# EAGLE design Linetrackerboard (EAGLE 9.6.2)
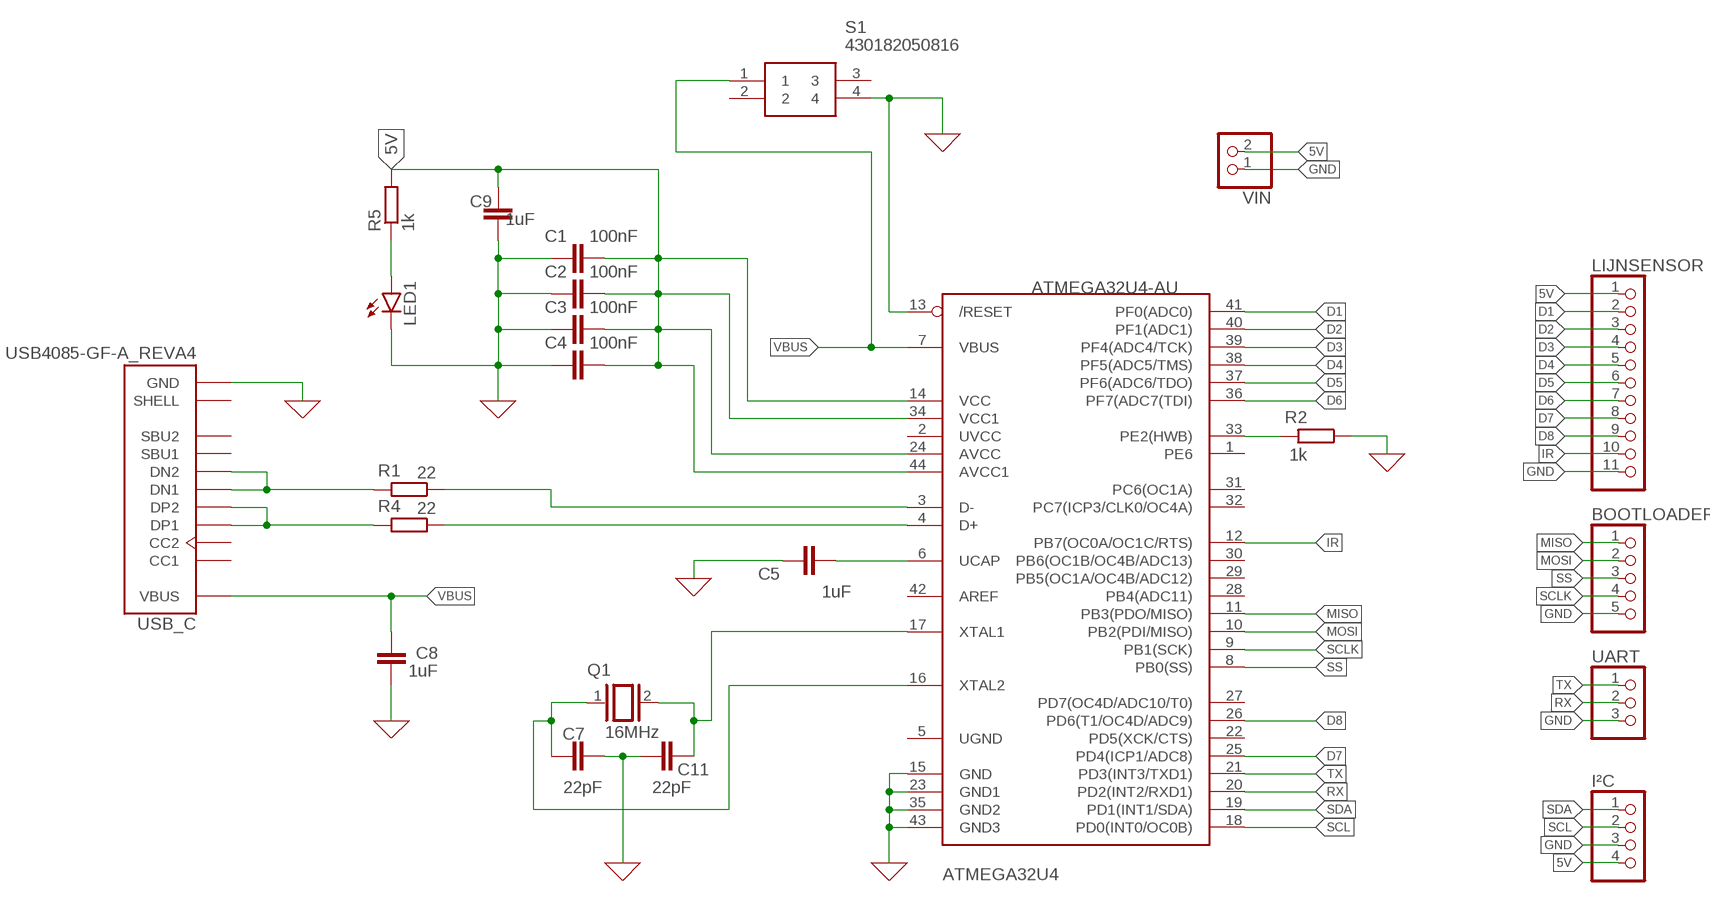
[diagram p0: schematic, sheet 1]

## Parts
ATMEGA32U4  ATMEGA32U4-AU  [TQFP44]
BOOTLOADER  PINHD-1X5  [1X05]
C1  100nF  C-EUC0805  [C0805]
C2  100nF  C-EUC0805  [C0805]
C3  100nF  C-EUC0805  [C0805]
C4  100nF  C-EUC0805  [C0805]
C5  1uF  C-EUC0805  [C0805]
C7  22pF  C-EUC0805  [C0805]
C8  1uF  C-EUC0603  [C0603]
C9  1uF  C-EUC0603  [C0603]
C11  22pF  C-EUC0805  [C0805]
I²C  PINHD-1X4  [1X04]
LED1  LED  [SMARTLED-TTW]
LIJNSENSOR  PINHD-1X11  [1X11]
Q1  16MHz  XTAL/S  [QS]
R1  22  R-EU_M0805  [M0805]
R2  1k  R-EU_M0805  [M0805]
R4  22  R-EU_M0805  [M0805]
R5  1k  R-EU_M0805  [M0805]
S1  430182050816  [430182070816]
UART  PINHD-1X3  [1X03]
USB_C  USB4085-GF-A_REVA4  [GCT_USB4085-GF-A_REVA4]
VIN  PINHD-1X2  [1X02]

## Nets
0: ATMEGA32U4.13(/RESET) ATMEGA32U4.15(GND) ATMEGA32U4.23(GND1) ATMEGA32U4.35(GND2) ATMEGA32U4.43(GND3) C1.1 C2.1 C3.1 C4.1 C5.1 C7.2 C8.2 C9.1 C11.1 LED1.C@1(C) R2.1 S1.4 USB_C.A1(GND) USB_C.A12(GND) USB_C.B1(GND) USB_C.B12(GND) ; supply symbol labelled GND
5V: ATMEGA32U4.14(VCC) ATMEGA32U4.24(AVCC) ATMEGA32U4.34(VCC1) ATMEGA32U4.44(AVCC1) C1.2 C2.2 C3.2 C4.2 C9.2 I²C.4 LIJNSENSOR.1 R5.2 VIN.2
D1: ATMEGA32U4.41(PF0(ADC0)) LIJNSENSOR.2
D2: ATMEGA32U4.40(PF1(ADC1)) LIJNSENSOR.3
D3: ATMEGA32U4.39(PF4(ADC4/TCK)) LIJNSENSOR.4
D4: ATMEGA32U4.38(PF5(ADC5/TMS)) LIJNSENSOR.5
D5: ATMEGA32U4.37(PF6(ADC6/TDO)) LIJNSENSOR.6
D6: ATMEGA32U4.36(PF7(ADC7(TDI)) LIJNSENSOR.7
D7: ATMEGA32U4.25(PD4(ICP1/ADC8)) LIJNSENSOR.8
D8: ATMEGA32U4.26(PD6(T1/OC4D/ADC9)) LIJNSENSOR.9
D+: ATMEGA32U4.4(D+) R4.1 R4.2 USB_C.A6(DP1) USB_C.B6(DP2)
D-: ATMEGA32U4.3(D-) R1.1 R1.2 USB_C.A7(DN1) USB_C.B7(DN2)
GND: BOOTLOADER.5 I²C.3 LIJNSENSOR.11 UART.3 VIN.1
IR: ATMEGA32U4.12(PB7(OC0A/OC1C/RTS)) LIJNSENSOR.10
MISO: ATMEGA32U4.11(PB3(PDO/MISO)) BOOTLOADER.1
MOSI: ATMEGA32U4.10(PB2(PDI/MISO)) BOOTLOADER.2
N$1: ATMEGA32U4.17(XTAL1) C11.2 Q1.2
N$2: ATMEGA32U4.16(XTAL2) C7.1 Q1.1
N$3: ATMEGA32U4.33(PE2(HWB)) R2.2
N$4: LED1.A@1(A) R5.1
N$12: ATMEGA32U4.6(UCAP) C5.2
RX: ATMEGA32U4.20(PD2(INT2/RXD1)) UART.2
SCL: ATMEGA32U4.18(PD0(INT0/OC0B)) I²C.2
SCLK: ATMEGA32U4.9(PB1(SCK)) BOOTLOADER.4
SDA: ATMEGA32U4.19(PD1(INT1/SDA)) I²C.1
SS: ATMEGA32U4.8(PB0(SS)) BOOTLOADER.3
TX: ATMEGA32U4.21(PD3(INT3/TXD1)) UART.1
VBUS: ATMEGA32U4.7(VBUS) C8.1 S1.1 USB_C.A4(VBUS) USB_C.A9(VBUS) USB_C.B4(VBUS) USB_C.B9(VBUS)
Unconnected: ATMEGA32U4.1(PE6) ATMEGA32U4.2(UVCC) ATMEGA32U4.5(UGND) ATMEGA32U4.22(PD5(XCK/CTS)) ATMEGA32U4.27(PD7(OC4D/ADC10/T0)) ATMEGA32U4.28(PB4(ADC11)) ATMEGA32U4.29(PB5(OC1A/OC4B/ADC12)) ATMEGA32U4.30(PB6(OC1B/OC4B/ADC13)) ATMEGA32U4.31(PC6(OC1A)) ATMEGA32U4.32(PC7(ICP3/CLK0/OC4A)) ATMEGA32U4.42(AREF) S1.2 S1.3 USB_C.A5(CC1) USB_C.A8(SBU1) USB_C.B5(CC2) USB_C.B8(SBU2) USB_C.P1(SHELL) USB_C.P2(SHELL) USB_C.P3(SHELL) USB_C.P4(SHELL)

## Library data of the parts
ATMEGA32U4 = adaprog:ATMEGA32U4
BOOTLOADER = pinhead:PINHD-1X5: PIN HEADER
C1-C5 C7-C9 C11 = rcl:C-EU: CAPACITOR, European symbol; SPICEPREFIX: C
I²C = pinhead:PINHD-1X4: PIN HEADER
LED1 = led:LED: LED OSRAM: - CHIPLED LG R971, LG N971, LY N971, LG Q971, LY Q971, LO R971, LY R971 LH N974, LH R974 LS Q976, LO Q976, LY Q976 LO Q996 - Hyper CHIPLED LW Q18S LB Q993, LB Q99A, LB R99A - SideLED LS A670, LO A670, LY A670, LG A670, LP A670 LB A673, LV A673, LT A673, LW A673 LH A674 LY A675 LS A676, LA A676, LO A676, LY A676, LW A676 LS A679, LY A679, LG A679 - Hyper Micro SIDELED® LS Y876, LA Y876, LO Y876, LY Y876 LT Y87S - SmartLED LW L88C, LW L88S LB L89C, LB L89S, LG L890 LS L89K, LO L89K, LY L89K LS L896, LA L896, LO L896, LY L896 - TOPLED LS T670, LO T670, LY T670, LG T670, LP T670 LSG T670, LSP T670, LSY T670, LOP T670, LYG T670 LG T671, LOG T671, LSG T671 LB T673, LV T673, LT T673, LW T673 LH T674 LS T676, LA T676, LO T676, LY T676, LB T676, LH T676, LSB T676, LW T676 LB T67C, LV T67C, LT T67C, LS T67K, LO T67K, LY T67K, LW E67C LS E67B, LA E67B, LO E67B, LY E67B, LB E67C, LV E67C, LT E67C LW T67C LS T679, LY T679, LG T679 LS T770, LO T770, LY T770, LG T770, LP T770 LB T773, LV T773, LT T773, LW T773 LH T774 LS E675, LA E675, LY E675, LS T675 LS T776, LA T776, LO T776, LY T776, LB T776 LHGB T686 LT T68C, LB T68C - Hyper Mini TOPLED® LB M676 - Mini TOPLED Santana® LG M470 LS M47K, LO M47K, LY M47K Source: http://www.osram.convergy.de LUXEON: - LUMILED® LXK2-PW12-R00, LXK2-PW12-S00, LXK2-PW14-U00, LXK2-PW14-V00 LXK2-PM12-R00, LXK2-PM12-S00, LXK2-PM14-U00 LXK2-PE12-Q00, LXK2-PE12-R00, LXK2-PE12-S00, LXK2-PE14-T00, LXK2-PE14-U00 LXK2-PB12-K00, LXK2-PB12-L00, LXK2-PB12-M00, LXK2-PB14-N00, LXK2-PB14-P00, LXK2-PB14-Q00 LXK2-PR12-L00, LXK2-PR12-M00, LXK2-PR14-Q00, LXK2-PR14-R00 LXK2-PD12-Q00, LXK2-PD12-R00, LXK2-PD12-S00 LXK2-PH12-R00, LXK2-PH12-S00 LXK2-PL12-P00, LXK2-PL12-Q00, LXK2-PL12-R00 Source: www.luxeon.com KINGBRIGHT: KA-3528ASYC Source: www.kingbright.com
LIJNSENSOR = pinhead:PINHD-1X11: PIN HEADER
Q1 = special:XTAL/S: CRYSTAL
R1 R2 R4 R5 = rcl:R-EU_: RESISTOR, European symbol; SPICEPREFIX: R
S1 = push button:430182050816: Black Tactile Tactile Switch, NO 50 mA 1.6mm Surface Mount Source: Datasheet <http://katalog.we-online.de/em/datasheet/4301x2xxx8x6.pdf>; DESCRIPTION: Black Tactile Tactile Switch, NO 50 mA 1.6mm Surface Mount; HEIGHT: mm; MANUFACTURER_NAME: Wurth Elektronik; MANUFACTURER_PART_NUMBER: 430182050816; MOUSER_PART_NUMBER: 710-430182050816; MOUSER_PRICE-STOCK: https://www.mouser.co.uk/ProductDetail/Wurth-Elektronik/430182050816?qs=wr8lucFkNMUyle0jQPgWGw%3D%3D
UART = pinhead:PINHD-1X3: PIN HEADER
USB_C = USB4085-GF-A:USB4085-GF-A_REVA4: USB 2.0 Type C Receptacle Dip Type, PCB Top Mount Check availability <https://pricing.snapeda.com/parts/USB4085-GF-A/Global%20Connector%20Technology/view-part?ref=eda>; AVAILABILITY: In Stock; DESCRIPTION: USB-C (USB TYPE-C) USB 2.0 Receptacle Connector 24 (16+8 Dummy) Position Through Hole, Right Angle, low cost, 3.46mm profile, 16 pin, horizontal, Top mount; MF: Global Connector Technology; MP: USB4085-GF-A; PACKAGE: None; PRICE: None; PURCHASE-URL: https://pricing.snapeda.com/search/part/USB4085-GF-A/?ref=eda
VIN = pinhead:PINHD-1X2: PIN HEADER

## Board
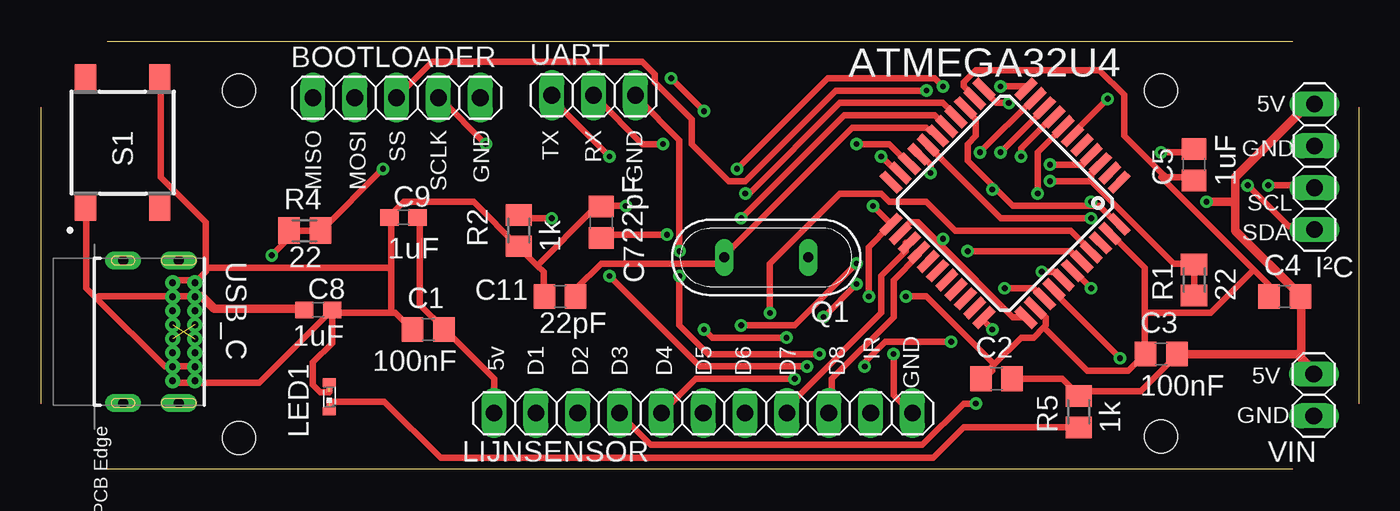
[diagram p1: board, top side]
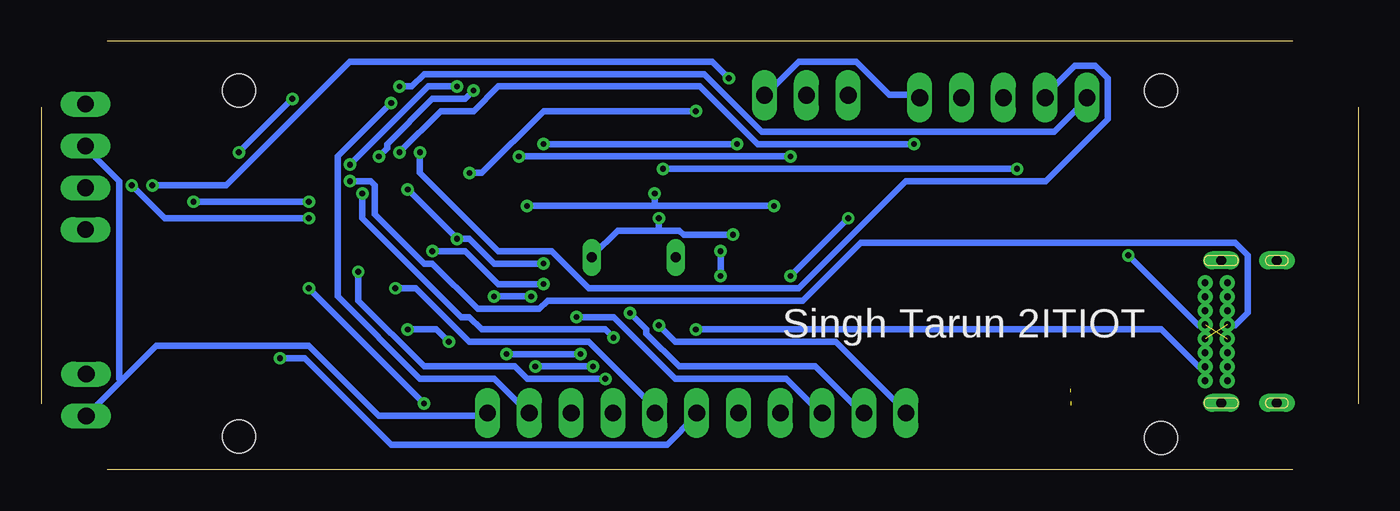
[diagram p2: board, bottom side, seen from below]

Size 80 x 26 mm. Coordinates in mm from the lower left corner, seen from the top.
Outline: 4,26 76,26
Outline: 80,22 80,4
Outline: 76,0 4,0
Outline: 0,4 0,22
Copper layers (1*16): Top 0.035mm / dielectric 1.5mm / Bottom 0.035mm
Design rules "default *": minimum track width 15mil, minimum drill 0.35mm, track to track 6mil, track to pad 6mil, pad to pad 6mil, via to via 6mil, smd to smd 6mil, copper to edge 20mil, drill to drill 6mil, minimum pad ring 10mil, minimum via ring 8mil, stop-mask expansion 4mil, vias tented up to drill 0mil, thermal gap 10mil
Holes 2 mm at 12,23 68,23 68,2 12,1.9

### Footprints (pad centres in the part's own frame; a part is rotated, then mirrored left to right if it is on the bottom)
TQFP44 = smd 1.5 x 0.5: 1 -5.8,4; 2 -5.8,3.2; 3 -5.8,2.4; 4 -5.8,1.6; 5 -5.8,0.8; 6 -5.8,0; 7 -5.8,-0.8; 8 -5.8,-1.6; 9 -5.8,-2.4; 10 -5.8,-3.2; 11 -5.8,-4; 23 5.8,-4; 24 5.8,-3.2; 25 5.8,-2.4; 26 5.8,-1.6; 27 5.8,-0.8; 28 5.8,0; 29 5.8,0.8; 30 5.8,1.6; 31 5.8,2.4; 32 5.8,3.2; 33 5.8,4 | smd 0.5 x 1.5: 12 -4,-5.8; 13 -3.2,-5.8; 14 -2.4,-5.8; 15 -1.6,-5.8; 16 -0.8,-5.8; 17 0,-5.8; 18 0.8,-5.8; 19 1.6,-5.8; 20 2.4,-5.8; 21 3.2,-5.8; 22 4,-5.8; 34 4,5.8; 35 3.2,5.8; 36 2.4,5.8; 37 1.6,5.8; 38 0.8,5.8; 39 0,5.8; 40 -0.8,5.8; 41 -1.6,5.8; 42 -2.4,5.8; 43 -3.2,5.8; 44 -4,5.8
1X05 = drill 1.016 long: 1 -5.08,0; 2 -2.54,0; 3 0,0; 4 2.54,0; 5 5.08,0
C0805 = smd 1.3 x 1.5: 1 -0.95,0; 2 0.95,0
C0603 = smd 1.1 x 1: 1 -0.85,0; 2 0.85,0
1X04 = drill 1.016 long: 1 -3.81,0; 2 -1.27,0; 3 1.27,0; 4 3.81,0
SMARTLED-TTW = smd 0.8 x 0.5: A 0,-0.875; C 0,0.875 | smd 0.35 x 0.35: A@1 0,-0.5; C@1 0,0.5
1X11 = drill 1.016 long: 1 -12.7,0; 2 -10.16,0; 3 -7.62,0; 4 -5.08,0; 5 -2.54,0; 6 0,0; 7 2.54,0; 8 5.08,0; 9 7.62,0; 10 10.16,0; 11 12.7,0
QS = drill 0.61 long: 1 -2.54,0; 2 2.54,0
M0805 = smd 1.3 x 1.6: 1 -0.95,0; 2 0.95,0
430182070816 = smd 1.55 x 1.3: 1 -3.975,2.25; 2 -3.975,-2.25; 3 3.975,2.25; 4 3.975,-2.25
1X03 = drill 1.016 long: 1 -2.54,0; 2 0,0; 3 2.54,0
GCT_USB4085-GF-A_REVA4 = drill 0.4 pad 0.65: A1 -2.975,4.025; A4 -2.125,4.025; A5 -1.275,4.025; A6 -0.425,4.025; A7 0.425,4.025; A8 1.275,4.025; A9 2.125,4.025; A12 2.975,4.025; B1 2.975,2.675; B4 2.125,2.675; B5 1.275,2.675; B6 0.425,2.675; B7 -0.425,2.675; B8 -1.275,2.675; B9 -2.125,2.675; B12 -2.975,2.675 | drill 0.6 pad 1.108 long: P1 -4.325,3.045; P2 4.325,3.045; P3 4.325,-0.335; P4 -4.325,-0.335
1X02 = drill 1.016 long: 1 -1.27,0; 2 1.27,0

### Placement (x,y rotation side)
ATMEGA32U4  58.52,16.16 225 top
BOOTLOADER  21.58,22.57 0 top
C1  23.5,8.5 0 top
C2  58,5.5 0 top
C3  68,7 0 top
C4  75.5,10.5 0 top
C5  70,18.5 90 top
C7  34,15 90 top
C8  16.82,9.69 0 top
C9  22,15.29 0 top
C11  31.5,10.5 0 top
I²C  77.31,18.37 90 top
LED1  17.5,4.4 0 top
LIJNSENSOR  40.2,3.42 0 top
Q1  44.02,12.87 180 top
R1  70,11.5 90 top
R2  29,14.5 90 top
R4  16,14.5 0 top
R5  63,3.5 90 top
S1  4.95,19.84 90 top
UART  33.54,22.72 0 top
USB_C  5.31,8.36 270 top
VIN  77.27,4.52 90 top

### Tracks (layer width: path | path; a pad name or v marks a point on that pad's centre or on a via)
0  (via drill 0.35)  (1 unrouted)
  Top 0.381: 57.88,6.38 59.5,8 60.25,8 60.88,8.62 | 57.88,6.38 57.75,6.25 57.75,6 57.25,5.5 C2.1 | 60.88,8.62 61,8.75 61,9.25 60.5,9.75 ATMEGA32U4.35 | 67,7 67,9.5 | 67,9.5 67,12.25 65,14.25 ATMEGA32U4.43 | 60.88,8.62 63.5,6 66,6 67,7 | 67,7 C3.1 | 68.12,17.88 68.25,17.75 70,17.75 C5.1 | 68.12,17.88 65.75,20.25 65.75,22.75 64.25,24.25 56.75,24.25 56,23.5 56,23.25 56.5,22.75 ATMEGA32U4.13 | 73.62,12.12 68,17.75 68.12,17.88 | 73.62,12.12 74.5,11.25 74.5,10.5 C4.1 | 67,9.5 71,9.5 73.62,12.12 | 10,12.25 10,12 USB_C.A1 9.25,11.5 8,11.5 USB_C.B12 | 10,12.25 10,15 7.25,17.75 7.25,23.75 S1.4 | USB_C.B1 8,5.25 9.25,5.25 USB_C.A12 9.5,5.25 13.25,5.25 17.5,9.5 C8.2 | 21.25,9.5 21.5,9.5 22.5,8.5 C1.1 | 21.25,9.5 17.75,9.5 C8.2 | 21.25,9.5 21.25,12.25 | 21.25,12.25 21.25,15.25 C9.1 21.25,15.5 22,16.25 26.25,16.25 29,13.5 | 21.25,12.25 10,12.25 | 29,13.5 30.12,12.38 | 30.12,12.38 30.5,12 30.5,10.5 C11.1 | v50.5,16 51.5,15 ATMEGA32U4.23 51.5,14.75 50.25,13.5 v50.25,10.5 | v35.5,16 34,16 C7.2 34,15.75 33.5,15.75 30.12,12.38 | v42.75,16.75 43,16.75 48.5,22.25 54.75,22.25 55.5,21.5 ATMEGA32U4.15 | 29,13.5 R2.1 | 57.88,6.38 53.75,10.5 v52.5,10.5 | C8.2 17.67,7.67 16.5,6.5 16.5,5.14 16.96,4.68 17.5,4.68
  Bottom 0.381: v35.5,16 42.75,16 | 42.75,16 v50.5,16 | 42.75,16 v42.75,16.75 | v50.25,10.5 v52.5,10.5
5V  (via drill 0.35)
  Top 0.381: C2.2 62,5.5 63,4.5 R5.2 63,4.75 66.75,4.75 69,7 C3.2 | 76.25,7 76.38,6.88 76.5,7 | 76.75,22 77.25,22 I²C.4 | 76.5,10.5 C4.2 | 24.5,8.5 23,10 23,15.25 C9.2 | LIJNSENSOR.1 27.5,5.5 24.5,8.5 | 24.5,8.5 C1.2 | 54.62,13.62 59,9.25 59.75,9.25 ATMEGA32U4.34 | 54.62,13.62 53.25,15 52.75,15 52.25,14.5 ATMEGA32U4.24 | 57.88,17.12 59,16 63.75,16 | 57.88,17.12 56.25,18.75 56.25,19.75 56.75,20.25 56.75,21.25 56.25,21.75 ATMEGA32U4.14 | 63.75,16 64.25,16 65.25,15 ATMEGA32U4.44 | v54.75,14 54.75,13.75 54.62,13.62 | v57.75,17 57.88,17.12 | v42.5,8.75 45.75,8.75 v49.5,12.5 | 63.75,16 v63.75,16.25
  Top 0.508: 76.25,7 69,7 | 76.38,6.88 77.25,6 VIN.2 | 76.5,7 76.5,10.5 72.5,14.5 72.5,16.25 | 76.75,22 72.5,17.75 72.5,16.25 | v70.75,16.25 72.5,16.25
  Bottom 0.381: v57.75,17 v54.75,14 54,14 52.5,12.5 v49.5,12.5 | v42.5,8.75 41.5,7.75 31.75,7.75 27.5,3.5 LIJNSENSOR.1 | v63.75,16.25 v70.75,16.25
D1  (via drill 0.35)
  Top 0.381: v44.25,9.5 44.25,12.5 48.5,16.75 51,16.75 51.5,16.25 53.75,16.25 55.5,14.5 62.5,14.5 63.75,13.25 ATMEGA32U4.41
  Bottom 0.381: v44.25,9.5 43.25,8.5 43.25,8.25 41.25,6.25 33,6.25 30.25,3.5 LIJNSENSOR.2
D2  (via drill 0.35)
  Top 0.381: v56.25,13.25 62.5,13.25 63,12.75 ATMEGA32U4.40 | v47.5,9.25 v49.5,11.25
  Bottom 0.381: v56.25,13.25 54.25,13.25 52.25,11.25 v49.5,11.25 | v47.5,9.25 45.25,9.25 41.5,5.5 34.75,5.5 32.75,3.5 LIJNSENSOR.3
D3  (via drill 0.35)
  Top 0.381: v63.75,11 62.75,12 ATMEGA32U4.39 | v56.75,4 56,4 53.5,1.5 37,1.5 35.25,3.25 LIJNSENSOR.4
  Bottom 0.381: v56.75,4 v63.75,11
D4  (via drill 0.35)
  Top 0.381: v60.75,12 61.5,12 62,11.5 ATMEGA32U4.38 | v45.75,5.5 39.75,5.5 37.75,3.5 LIJNSENSOR.5
  Bottom 0.381: v60.75,12 60.75,10.25 56.75,6.25 51.25,6.25 50.5,5.5 v45.75,5.5
D5  (via drill 0.35)
  Top 0.381: v65.5,6.75 61.5,10.75 ATMEGA32U4.37
  Bottom 0.381: v65.5,6.75 64,6.75 58.75,1.5 42,1.5 40.25,3.25 LIJNSENSOR.6
D6  (via drill 0.35)
  Top 0.381: v58.5,11 60.25,11 60.75,10.5 ATMEGA32U4.36
  Bottom 0.381: v58.5,11 57.25,11 54,7.75 46.75,7.75 42.5,3.5 LIJNSENSOR.7
D7
  Top 0.381: ATMEGA32U4.25 52.5,13.75 52.5,13.25 51,11.75 51,9.5 45.5,4 45.5,3.5 LIJNSENSOR.8
D8
  Top 0.381: ATMEGA32U4.26 53.25,13 51.75,11.5 51.75,9.25 48,5.5 48,3.5 LIJNSENSOR.9
D+  (via drill 0.35)  (1 unrouted)
  Top 0.381: v61.25,18.5 63.25,18.5 63.75,19 ATMEGA32U4.4 | v54.75,23.25 54.25,23.75 47.75,23.75 v42.25,18.25 | v20.75,18.25 17,14.5 R4.2 15.5,14.5 | 15.5,14.5 R4.1 15.25,14.5 | 15.5,14.5 v14,13
  Bottom 0.381: v61.25,18.5 56.5,23.25 v54.75,23.25 | v20.75,18.25 v42.25,18.25 | v14,13 9.75,8.75 9.5,8.75 USB_C.A6
D-  (via drill 0.35)  (1 unrouted)
  Top 0.381: 63.75,17.5 63.75,18 64.25,18.5 ATMEGA32U4.3 | 63.75,17.5 68.75,12.5 70,12.5 R1.2 R1.1 | 63.75,17.5 v61.25,17.5
  Bottom 0.381: v61.25,17.5 60,17.5 59.75,17.25 59.75,15.5 56.75,12.5 56.25,12.5 53.5,9.75 49.75,9.75 49.25,10.25 33.75,10.25 30.25,13.75 7.5,13.75 6.75,13 6.75,9.5 7.5,8.75 7.75,8.75 USB_C.B7
GND  (via drill 0.35)
  Top 0.381: v38.75,13.25 38.75,20 36.25,22.5 UART.3 | v38.75,11.75 38.75,8.75 40.5,7 v47.25,7 | v51.75,7 51.75,4.5 52.75,3.5 LIJNSENSOR.11
  Bottom 0.381: BOOTLOADER.5 26.75,22.75 28.5,22.75 30.5,24.75 34,24.75 36,22.75 UART.3 | 75.12,5.38 77.25,3.25 VIN.1 | 75.12,5.38 73,7.5 63.75,7.5 59.5,3.25 53,3.25 LIJNSENSOR.11 | I²C.3 77.25,19.5 75.25,17.5 75.25,5.5 75.12,5.38 | v38.75,11.75 v38.75,13.25 | v51.75,7 v47.25,7
IR  (via drill 0.35)
  Top 0.381: v58.75,22.25 58,22.25 57.25,23 ATMEGA32U4.12
  Bottom 0.381: v58.75,22.25 62,19 62,10.5 57,5.5 52.5,5.5 50.5,3.5 LIJNSENSOR.10
MISO  (via drill 0.35)
  Top 0.381: v58.25,23.25 59.75,23.25 ATMEGA32U4.11
  Bottom 0.381: v58.25,23.25 57.5,23.25 56.75,24 39.75,24 36.25,20.5 18.5,20.5 16.5,22.5 BOOTLOADER.1
MOSI  (via drill 0.35)
  Top 0.381: v57,19.25 60.25,22.5 ATMEGA32U4.10
  Bottom 0.381: v57,19.25 57,18 52.25,13.25 49,13.25 46.75,11 34,11 27.5,17.5 19,17.5 15.25,21.25 15.25,23.75 16,24.5 17.25,24.5 19,22.75 BOOTLOADER.2
N$1
  Top 0.381: C11.2 32.5,10.5 32.5,11 34,12.5 41,12.5 41.25,12.75 Q1.2 41.5,13 49.25,20.75 53.75,20.75 54,20.5 54.25,20.5 ATMEGA32U4.17
N$2  (via drill 0.35)
  Top 0.381: v38,14.25 34,14.25 C7.1 | v42.5,15.25 48.75,21.5 54.25,21.5 54.75,21 ATMEGA32U4.16
  Bottom 0.381: v38,14.25 41,14.25 41.25,14.5 42.5,14.5 | 42.5,14.5 45,14.5 46.5,13 Q1.1 | 42.5,14.5 v42.5,15.25
N$3  (via drill 0.35)
  Top 0.381: v57.75,8.5 57.25,9 ATMEGA32U4.33 | v55.25,7.75 51.25,7.75 50,6.5 v50,6.25 | v46.5,6.25 40,6.25 v34.5,11.75 | v31,15.25 29,15.25 R2.2
  Bottom 0.381: v57.75,8.5 56,8.5 v55.25,7.75 | v46.5,6.25 v50,6.25 | v31,15.25 v34.5,11.75
N$4  (1 unrouted)
  Top 0.381: R5.1 56,2.55 54.15,0.7 24.26,0.7 20.84,4.12 17.5,4.12 17.5,4.15
N$12  (via drill 0.35)
  Top 0.381: v64.75,22.5 62.75,20.5 ATMEGA32U4.6 | v68,19.25 70,19.25 C5.2
  Bottom 0.381: v68,19.25 v64.75,22.5
RX  (via drill 0.35)
  Top 0.381: v49.5,19.75 51.5,19.75 52.5,18.75 ATMEGA32U4.20 | v37.75,19.75 36.5,19.75 33.75,22.5 UART.2
  Bottom 0.381: v37.75,19.75 v49.5,19.75
SCL  (via drill 0.35)
  Top 0.381: v63.75,15.25 58.25,15.25 54,19.5 ATMEGA32U4.18 | v74.5,17.25 77.25,17.25 I²C.2
  Bottom 0.381: v63.75,15.25 72.5,15.25 v74.5,17.25
SCLK  (via drill 0.35)
  Top 0.381: v58.25,19.25 60.75,21.75 ATMEGA32U4.9 | v27,19.75 24.25,22.5 BOOTLOADER.4
  Bottom 0.381: v58.25,19.25 55.75,21.75 53.75,21.75 52.25,23.25 40,23.25 36.5,19.75 v27,19.75
SDA  (via drill 0.35)
  Top 0.381: v54,18 54,18.5 53.5,19 ATMEGA32U4.19 | v38.25,23.75 v40.25,21.75 | v73.25,17.25 75.75,14.75 77.25,14.75 I²C.1
  Bottom 0.381: v54,18 53.25,18 49.5,21.75 v40.25,21.75 | v38.25,23.75 39.25,24.75 61.25,24.75 68.75,17.25 v73.25,17.25
SS  (via drill 0.35)
  Top 0.381: v59.5,19 59.5,19.5 61.25,21.25 ATMEGA32U4.8 | v53.75,23 48.25,23 42.75,17.5 41.75,17.5 39.5,19.75 39.5,21.25 37.25,23.5 37.25,24 36.5,24.75 23.75,24.75 21.75,22.75 BOOTLOADER.3
  Bottom 0.381: v59.5,19 59,19.5 59,19.75 56.25,22.5 54.25,22.5 v53.75,23
TX  (via drill 0.35)
  Top 0.381: v51,19 52,18 ATMEGA32U4.21 | v34.5,19 31,22.5 UART.1
  Bottom 0.381: v34.5,19 v51,19
VBUS  (via drill 0.35)
  Top 0.381: 9.75,10.5 9.5,10.5 USB_C.A4 9.25,10.5 8,10.5 USB_C.B9 7.75,10.5 3.5,10.5 3.38,10.38 | 15.75,9.75 C8.1 | 3.38,10.38 7.5,6.25 7.75,6.25 USB_C.B4 8,6.25 9.25,6.25 USB_C.A9 | 3.38,10.38 2.75,11 2.75,15.75 S1.1 | v60.5,16.75 60.5,19.25 62,20.75 ATMEGA32U4.7 | v45.25,8 40.75,8 v40.25,8.5
  Top 0.508: 15.75,9.75 10.5,9.75 9.75,10.5
  Bottom 0.381: v60.5,16.75 60.5,15.25 54.5,9.25 54,9.25 53.25,8.5 45.75,8.5 v45.25,8 | v40.25,8.5 12,8.5 9.75,6.25 9.5,6.25 USB_C.A9

### Text on the board
tNames: 5V | MISO | MOSI | SS | SCLK | GND | TX | RX | GND | GND | SCL | SDA | 5v | D1 | D2 | D3 | D4 | D5 | D6 | D7 | D8 | IR | GND | 5V | GND
bNames: Singh Tarun 2ITIOT